# Altium schematic sheet scu.SchDoc
size A4; Organization: Altium Limited; Address1: L3, 12a Rodborough Rd; Address2: Frenchs Forest; Address3: NSW; Address4: Australia 2086
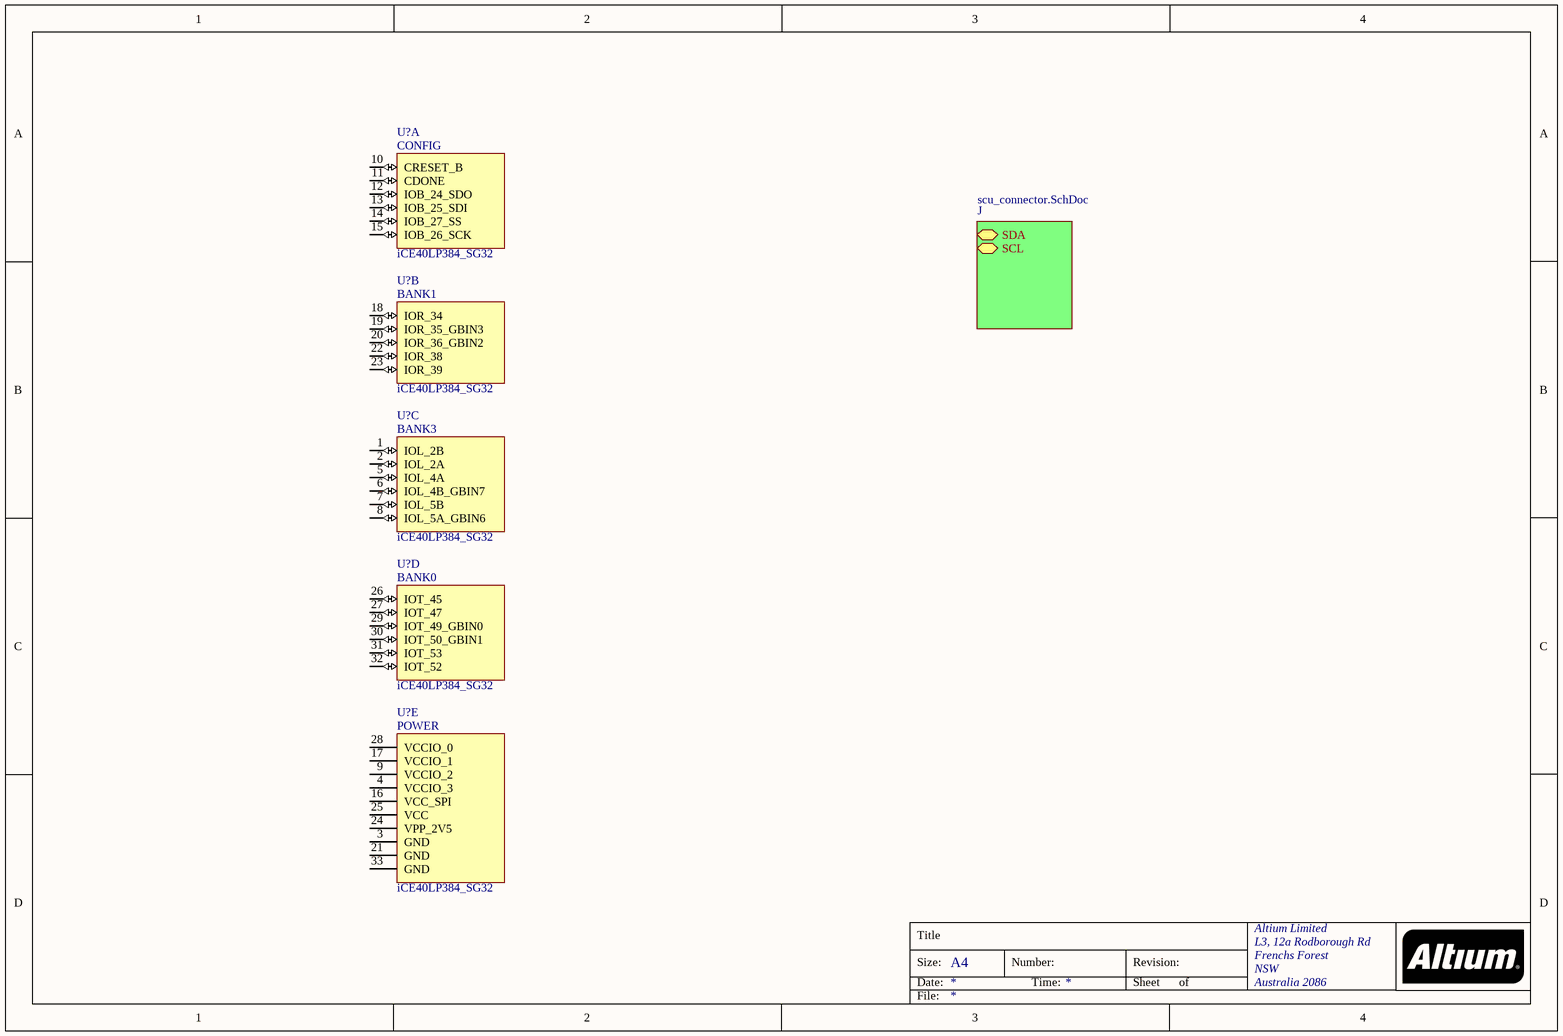
[diagram p0: scu.SchDoc]

## Parts
(Parts that share a designator on the sheet are numbered #1, #2 ... from top to bottom, then left to right.)
U?#1  iCE40LP384_SG32  (part A of 5)
U?#2  iCE40LP384_SG32  (part B of 5)
U?#3  iCE40LP384_SG32  (part C of 5)
U?#4  iCE40LP384_SG32  (part D of 5)
U?#5  iCE40LP384_SG32  (part E of 5)

## Sub-sheets
J = scu_connector.SchDoc: SDA (bidir), SCL

## Nets

Not connected (* = marked no-connect by the designer): U?#1 10(CRESET_B) 11(CDONE) 12(IOB_24_SDO) 13(IOB_25_SDI) 14(IOB_27_SS) 15(IOB_26_SCK); U?#2 18(IOR_34) 19(IOR_35_GBIN3) 20(IOR_36_GBIN2) 22(IOR_38) 23(IOR_39); U?#3 1(IOL_2B) 2(IOL_2A) 5(IOL_4A) 6(IOL_4B_GBIN7) 7(IOL_5B) 8(IOL_5A_GBIN6); U?#4 26(IOT_45) 27(IOT_47) 29(IOT_49_GBIN0) 30(IOT_50_GBIN1) 31(IOT_53) 32(IOT_52); U?#5 3(GND) 4(VCCIO_3) 9(VCCIO_2) 16(VCC_SPI) 17(VCCIO_1) 21(GND) 24(VPP_2V5) 25(VCC) 28(VCCIO_0) 33(GND)

## Notes on the sheet
- Title
- Size:
- Date:
- A4
- Number:
- Time:
- Revision:
- Sheet
- of
- File:
- (in symbol iCE40LP384_SG32, part A) CONFIG
- (in symbol iCE40LP384_SG32, part B) BANK1
- (in symbol iCE40LP384_SG32, part C) BANK3
- (in symbol iCE40LP384_SG32, part D) BANK0
- (in symbol iCE40LP384_SG32, part E) POWER